# EAGLE design pendant (EAGLE 6.6.0)
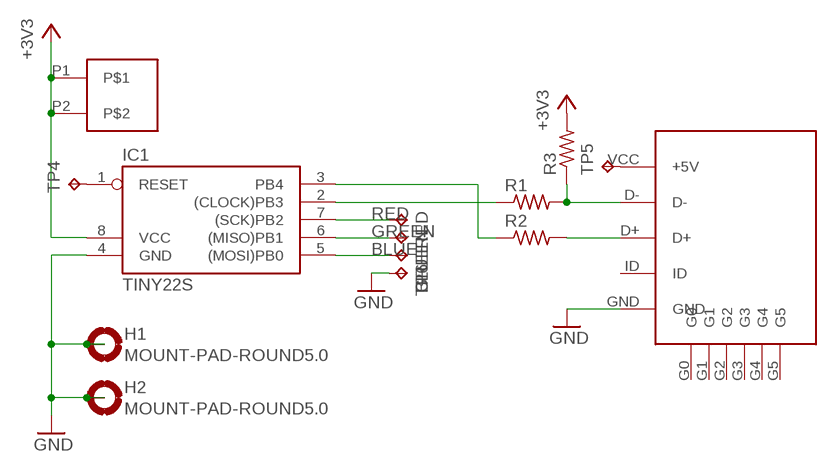
[diagram p0: schematic, sheet 1]

## Parts
BLUE  TPPAD1-13  [P1-13]
GREEN  TPPAD1-13  [P1-13]
H1  MOUNT-PAD-ROUND5.0  [5,0-PAD]
H2  MOUNT-PAD-ROUND5.0  [5,0-PAD]
IC1  TINY22S  [SOIC8]
R1  R-US_R0603  [R0603]
R2  R-US_R0603  [R0603]
R3  R-US_R0603  [R0603]
RED  TPPAD1-13  [P1-13]
TP4  TPPAD1-13  [P1-13]
TP5  TPTP10SQ  [TP10SQ]
TP6  TPPAD1-13  [P1-13]
U$1  USB-MICRO  [UB-MC5BR3-M404]
U$2  MAGNET8TH-INCH  [8TH-SQUARE]

## Nets
+3V3: IC1.8(VCC) R3.2 U$2.P1 U$2.P2
BLUE: BLUE.TP IC1.5((MOSI)PB0)
GND: H1.B5(MOUNT) H2.B5(MOUNT) IC1.4(GND) TP6.TP U$1.GND
GREEN: GREEN.TP IC1.6((MISO)PB1)
N$1: R1.2 R3.1 U$1.D-
N$2: R2.2 U$1.D+
N$3: IC1.2((CLOCK)PB3) R1.1
N$4: IC1.3(PB4) R2.1
N$5: IC1.1(RESET) TP4.TP
N$6: TP5.TP U$1.VCC(+5V)
RED: IC1.7((SCK)PB2) RED.TP
Unconnected: U$1.ID

## Power pins joined to a net without a drawn wire
G0: U$1.G0
G1: U$1.G1
G2: U$1.G2
G3: U$1.G3
G4: U$1.G4
G5: U$1.G5

## Library data of the parts
BLUE GREEN RED TP4-TP6 = testpad:TP: Test pad
H1 H2 = holes:MOUNT-PAD-ROUND: MOUNTING PAD, round
IC1 = atmel:TINY22: MICROCONTROLLER 1K ROM 128 bytes RAM 128 bytes EEPROM; OC_FARNELL: unknown; OC_NEWARK: unknown
R1-R3 = resistor:R-US_: RESISTOR, American symbol
U$1 = pendant:USB-MICRO
U$2 = pendant:MAGNET

## Board
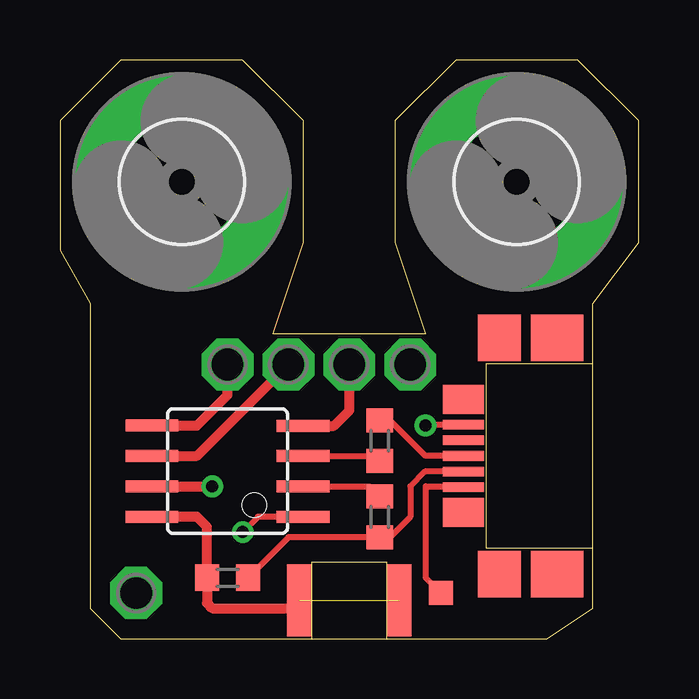
[diagram p1: board, top side]
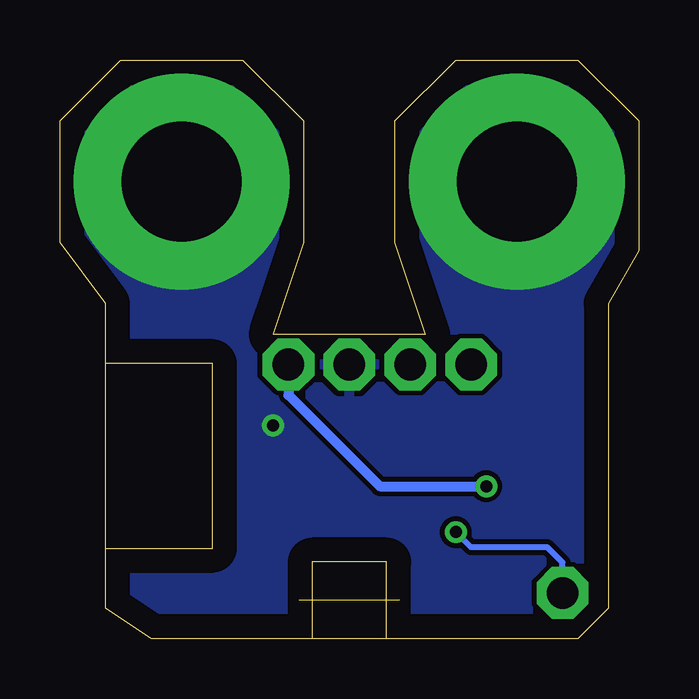
[diagram p2: board, bottom side, seen from below]

Size 24.13 x 24.13 mm. Coordinates in mm from the lower left corner, seen from the top.
Outline: 1.27,1.27 2.54,0 20.3,0 22.23,1.27 22.23,13.97 24.13,16.51 24.13,21.59 21.59,24.13 16.51,24.13 13.97,21.59 13.97,16.51 15.24,12.7 8.89,12.7 10.16,16.51 10.16,21.59 7.62,24.13 2.54,24.13 0,21.59 0,16.18 1.27,13.97 1.27,1.27
Copper layers (1*16): Top 0.035mm / dielectric 1.5mm / Bottom 0.035mm
Design rules "default": minimum track width 10mil, minimum drill 24mil, track to track 8mil, track to pad 8mil, pad to pad 8mil, via to via 8mil, smd to smd 8mil, copper to edge 40mil, drill to drill 8mil, minimum pad ring 10mil, minimum via ring 8mil, stop-mask expansion 4mil, vias tented up to drill 0mil, thermal gap 10mil

### Footprints (pad centres in the part's own frame; a part is rotated, then mirrored left to right if it is on the bottom)
P1-13 = drill 1.321 pad 2.159 octagon: TP 0,0
5,0-PAD = drill 5 pad 9: B5 0,0
SOIC8 = smd 0.5 x 2.2: 1 -1.905,-3.154; 2 -0.645,-3.154; 3 0.625,-3.154; 4 1.895,-3.154; 5 1.905,3.154; 6 0.635,3.154; 7 -0.635,3.154; 8 -1.905,3.154
R0603 = smd 1 x 1.1: 1 -0.85,0; 2 0.85,0
TP10SQ = smd 1 x 1: TP 0,0
UB-MC5BR3-M404 = smd 0.4 x 1.7: D+ 0,5.4; D- -0.65,5.4; GND 1.3,5.4; ID 0.65,5.4; VCC -1.3,5.4 | smd 1.95 x 2.2: G0 -4.925,1.5; G2 4.925,1.5 | smd 1.95 x 1.8: G1 -4.925,3.9; G3 4.925,3.9 | smd 1.2 x 1.7: G4 -2.35,5.4; G5 2.35,5.4
8TH-SQUARE = smd 1 x 3: P1 -2.1,1.6; P2 2.1,1.6

### Placement (x,y rotation side)
BLUE  6.99,11.43 0 top
GREEN  9.53,11.43 0 top
H1  5.08,19.05 0 top
H2  19.05,19.05 0 top
IC1  6.99,6.99 90 top
R1  13.34,5.08 270 top
R2  13.34,8.26 90 top
R3  6.99,2.54 180 top
RED  14.61,11.43 0 top
TP4  3.17,1.91 0 top
TP5  15.88,1.91 0 top
TP6  12.06,11.43 0 top
U$1  22.23,7.62 90 top
U$2  12.06,0 0 top

### Tracks (layer width: path | path; a pad name or v marks a point on that pad's centre or on a via)
+3V3  (1 unrouted)
  Top 0.406: IC1.8 5.71,5.08 6.13,4.66 R3.2 6.13,1.49 6.35,1.27 9.63,1.27 U$2.P1
BLUE
  Top 0.406: IC1.5 5.71,8.89 6.99,10.16 BLUE.TP
GND  (via drill 0.5)
  Top 0.254: U$1.GND 15.27,8.92 v15.24,8.89
  Top 0.406: IC1.4 11.42,8.88 12.06,9.53 TP6.TP
  pour Bottom: -1.27,13.97 30.48,13.97 30.48,-1.27 -1.27,-1.27
  pour Bottom (no thermals): -1.27,27.94 30.48,27.94 30.48,13.97 -1.27,13.97
GREEN
  Top 0.406: IC1.6 5.71,7.62 GREEN.TP
N$1
  Top 0.254: U$1.D- 15.22,6.97 14.61,6.35 14.61,5.08 13.76,4.23 R1.2 9.53,4.23 R3.1
N$2
  Top 0.254: U$1.D+ 15.24,7.62 13.76,9.11 R2.2
N$3
  Top 0.254: IC1.2 12.93,6.34 R1.1
N$4
  Top 0.254: IC1.3 13.13,7.61 R2.1
N$5  (via drill 0.5)
  Top 0.254: IC1.1 8.26,5.08 v7.62,4.45
  Bottom 0.254: TP4.TP 3.17,3.17 3.81,3.81 6.99,3.81 v7.62,4.45
N$6
  Top 0.254: U$1.VCC 15.27,6.32 15.24,6.35 15.24,2.54 TP5.TP
RED  (via drill 0.5)
  Top 0.406: IC1.7 v6.35,6.35
  Bottom 0.406: RED.TP 14.61,10.16 10.79,6.35 v6.35,6.35